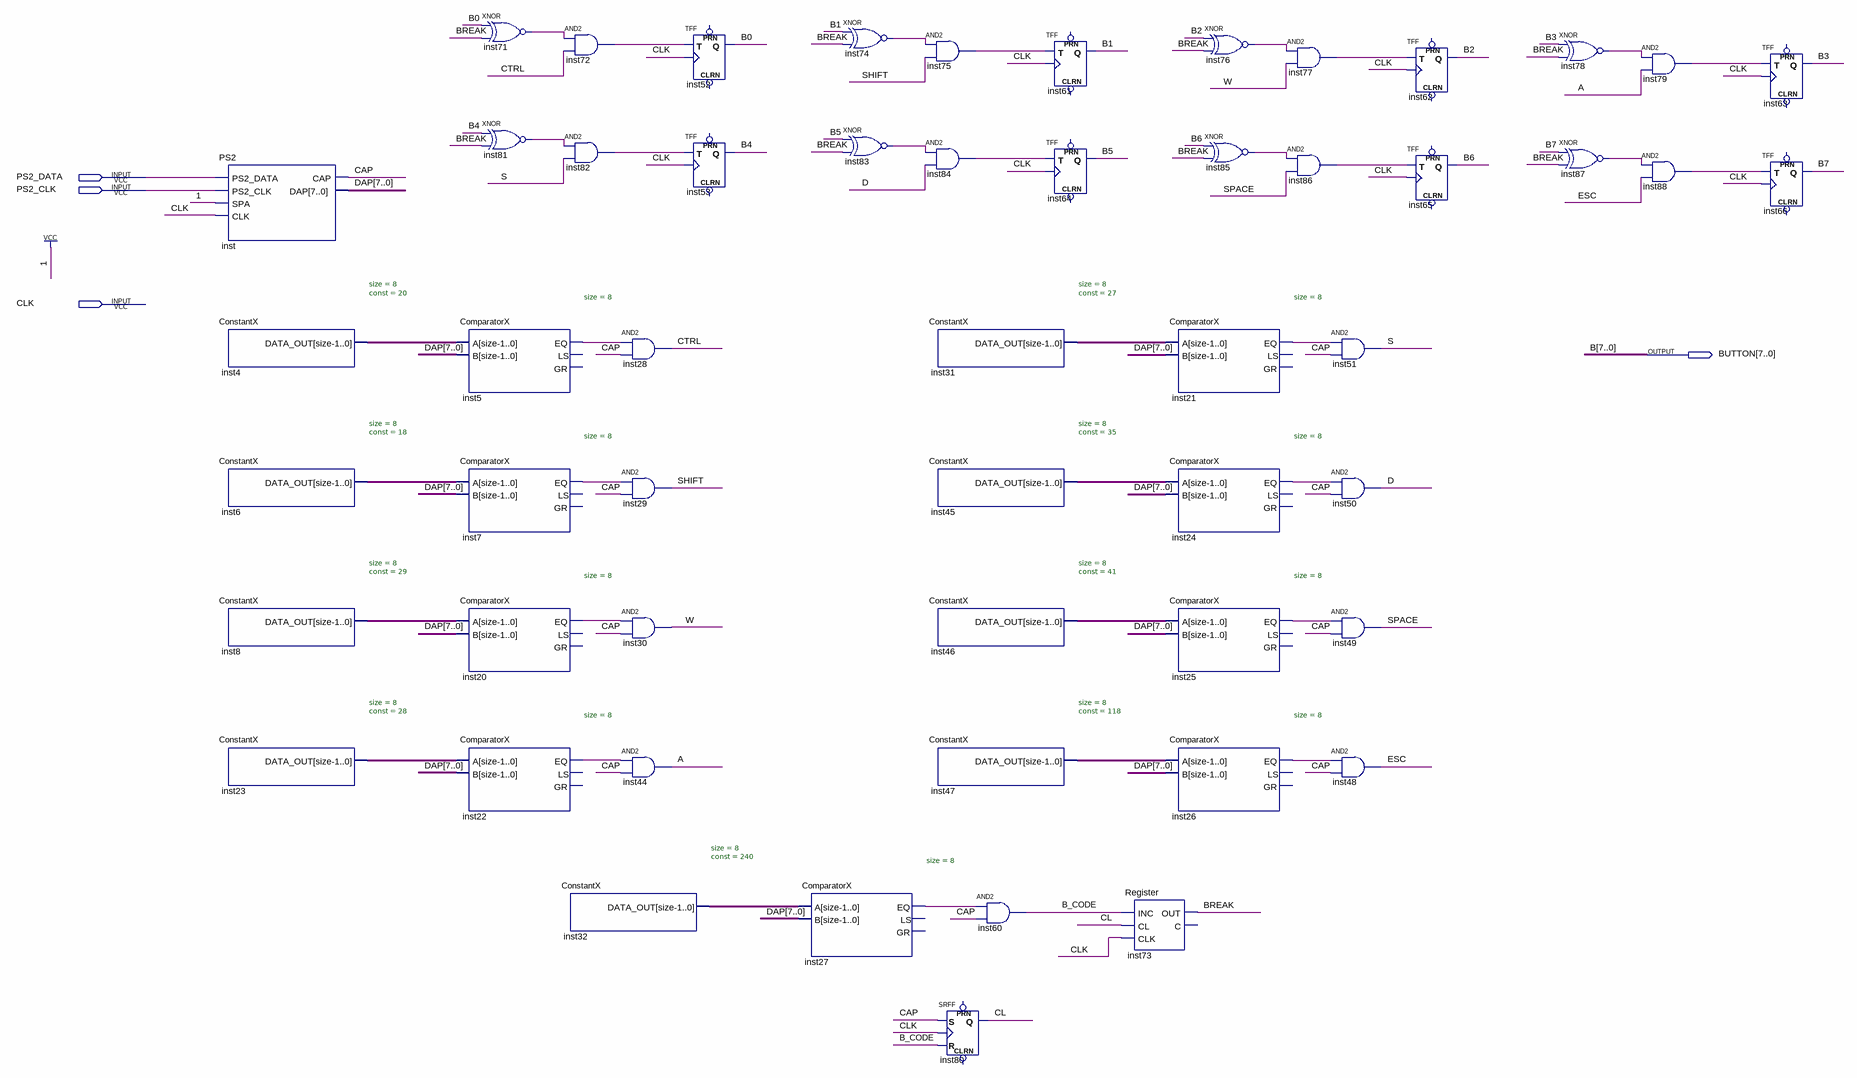
[diagram p0: schematic sheet]
// Quartus schematic keyboard.bdf as structural Verilog: 54 symbols, 4 pins
module keyboard (
  input  PS2_DATA,
  input  PS2_CLK,
  input  CLK,
  output [7:0] BUTTON
);

  wire A, B_CODE, BREAK, CAP, CL, CTRL, D, ESC, inst5_eq, inst7_eq, inst20_eq, inst21_eq, inst22_eq,
       inst24_eq, inst25_eq, inst26_eq, inst27_eq, inst71_out, inst72_out, inst74_out, inst75_out,
       inst76_out, inst77_out, inst78_out, inst79_out, inst81_out, inst82_out, inst83_out, inst84_out,
       inst85_out, inst86_out, inst87_out, inst88_out, S, SHIFT, SPACE, W;
  wire [7:0] DAP, inst4_data_out, inst6_data_out, inst8_data_out, inst23_data_out, inst31_data_out,
       inst32_data_out, inst45_data_out, inst46_data_out, inst47_data_out;

  PS2 inst (.PS2_DATA(PS2_DATA), .PS2_CLK(PS2_CLK), .SPA(1'b1), .CLK(CLK), .CAP(CAP), .DAP(DAP));
  ConstantX #(.size(8), .\const (20)) inst4 (.DATA_OUT(inst4_data_out));
  ConstantX #(.size(8), .\const (18)) inst6 (.DATA_OUT(inst6_data_out));
  ConstantX #(.size(8), .\const (29)) inst8 (.DATA_OUT(inst8_data_out));
  ConstantX #(.size(8), .\const (28)) inst23 (.DATA_OUT(inst23_data_out));
  ComparatorX #(.size(8)) inst5 (.A(inst4_data_out), .B(DAP), .EQ(inst5_eq));  // open: LS, GR
  ComparatorX #(.size(8)) inst7 (.A(inst6_data_out), .B(DAP), .EQ(inst7_eq));  // open: LS, GR
  ComparatorX #(.size(8)) inst20 (.A(inst8_data_out), .B(DAP), .EQ(inst20_eq));  // open: LS, GR
  ComparatorX #(.size(8)) inst22 (.A(inst23_data_out), .B(DAP), .EQ(inst22_eq));  // open: LS, GR
  xnor inst71 (inst71_out, BUTTON[0], BREAK);
  xnor inst81 (inst81_out, BUTTON[4], BREAK);
  and inst72 (inst72_out, inst71_out, CTRL);
  and inst82 (inst82_out, inst81_out, S);
  ConstantX #(.size(8), .\const (240)) inst32 (.DATA_OUT(inst32_data_out));
  and inst28 (CTRL, inst5_eq, CAP);
  and inst29 (SHIFT, inst7_eq, CAP);
  and inst30 (W, inst20_eq, CAP);
  and inst44 (A, inst22_eq, CAP);
  TFF inst52 (.T(inst72_out), .CLK(CLK), .Q(BUTTON[0]));  // open: PRN, CLRN
  TFF inst53 (.T(inst82_out), .CLK(CLK), .Q(BUTTON[4]));  // open: PRN, CLRN
  ComparatorX #(.size(8)) inst27 (.A(inst32_data_out), .B(DAP), .EQ(inst27_eq));  // open: LS, GR
  xnor inst74 (inst74_out, BUTTON[1], BREAK);
  xnor inst83 (inst83_out, BUTTON[5], BREAK);
  and inst75 (inst75_out, inst74_out, SHIFT);
  and inst84 (inst84_out, inst83_out, D);
  ConstantX #(.size(8), .\const (27)) inst31 (.DATA_OUT(inst31_data_out));
  ConstantX #(.size(8), .\const (35)) inst45 (.DATA_OUT(inst45_data_out));
  ConstantX #(.size(8), .\const (41)) inst46 (.DATA_OUT(inst46_data_out));
  ConstantX #(.size(8), .\const (118)) inst47 (.DATA_OUT(inst47_data_out));
  SRFF inst80 (.S(CAP), .R(B_CODE), .CLK(CLK), .Q(CL));  // open: PRN, CLRN
  and inst60 (B_CODE, inst27_eq, CAP);
  TFF inst61 (.T(inst75_out), .CLK(CLK), .Q(BUTTON[1]));  // open: PRN, CLRN
  TFF inst64 (.T(inst84_out), .CLK(CLK), .Q(BUTTON[5]));  // open: PRN, CLRN
  Register inst73 (.INC(B_CODE), .CL(CL), .CLK(CLK), .OUT(BREAK));  // open: C
  ComparatorX #(.size(8)) inst21 (.A(inst31_data_out), .B(DAP), .EQ(inst21_eq));  // open: LS, GR
  ComparatorX #(.size(8)) inst24 (.A(inst45_data_out), .B(DAP), .EQ(inst24_eq));  // open: LS, GR
  ComparatorX #(.size(8)) inst25 (.A(inst46_data_out), .B(DAP), .EQ(inst25_eq));  // open: LS, GR
  ComparatorX #(.size(8)) inst26 (.A(inst47_data_out), .B(DAP), .EQ(inst26_eq));  // open: LS, GR
  xnor inst76 (inst76_out, BUTTON[2], BREAK);
  xnor inst85 (inst85_out, BUTTON[6], BREAK);
  and inst77 (inst77_out, inst76_out, W);
  and inst86 (inst86_out, inst85_out, SPACE);
  and inst51 (S, inst21_eq, CAP);
  and inst50 (D, inst24_eq, CAP);
  and inst49 (SPACE, inst25_eq, CAP);
  and inst48 (ESC, inst26_eq, CAP);
  TFF inst62 (.T(inst77_out), .CLK(CLK), .Q(BUTTON[2]));  // open: PRN, CLRN
  TFF inst65 (.T(inst86_out), .CLK(CLK), .Q(BUTTON[6]));  // open: PRN, CLRN
  xnor inst78 (inst78_out, BUTTON[3], BREAK);
  xnor inst87 (inst87_out, BUTTON[7], BREAK);
  and inst79 (inst79_out, inst78_out, A);
  and inst88 (inst88_out, inst87_out, ESC);
  TFF inst63 (.T(inst79_out), .CLK(CLK), .Q(BUTTON[3]));  // open: PRN, CLRN
  TFF inst66 (.T(inst88_out), .CLK(CLK), .Q(BUTTON[7]));  // open: PRN, CLRN

  // Other names for the same wires on the sheet: B[7:0] = BUTTON; B0 = BUTTON[0]; B1 = BUTTON[1]; B2 = BUTTON[2];
  //   B3 = BUTTON[3]; B4 = BUTTON[4]; B5 = BUTTON[5]; B6 = BUTTON[6]; B7 = BUTTON[7]
endmodule
